# EAGLE schematic HAS (EAGLE 9.0.0)
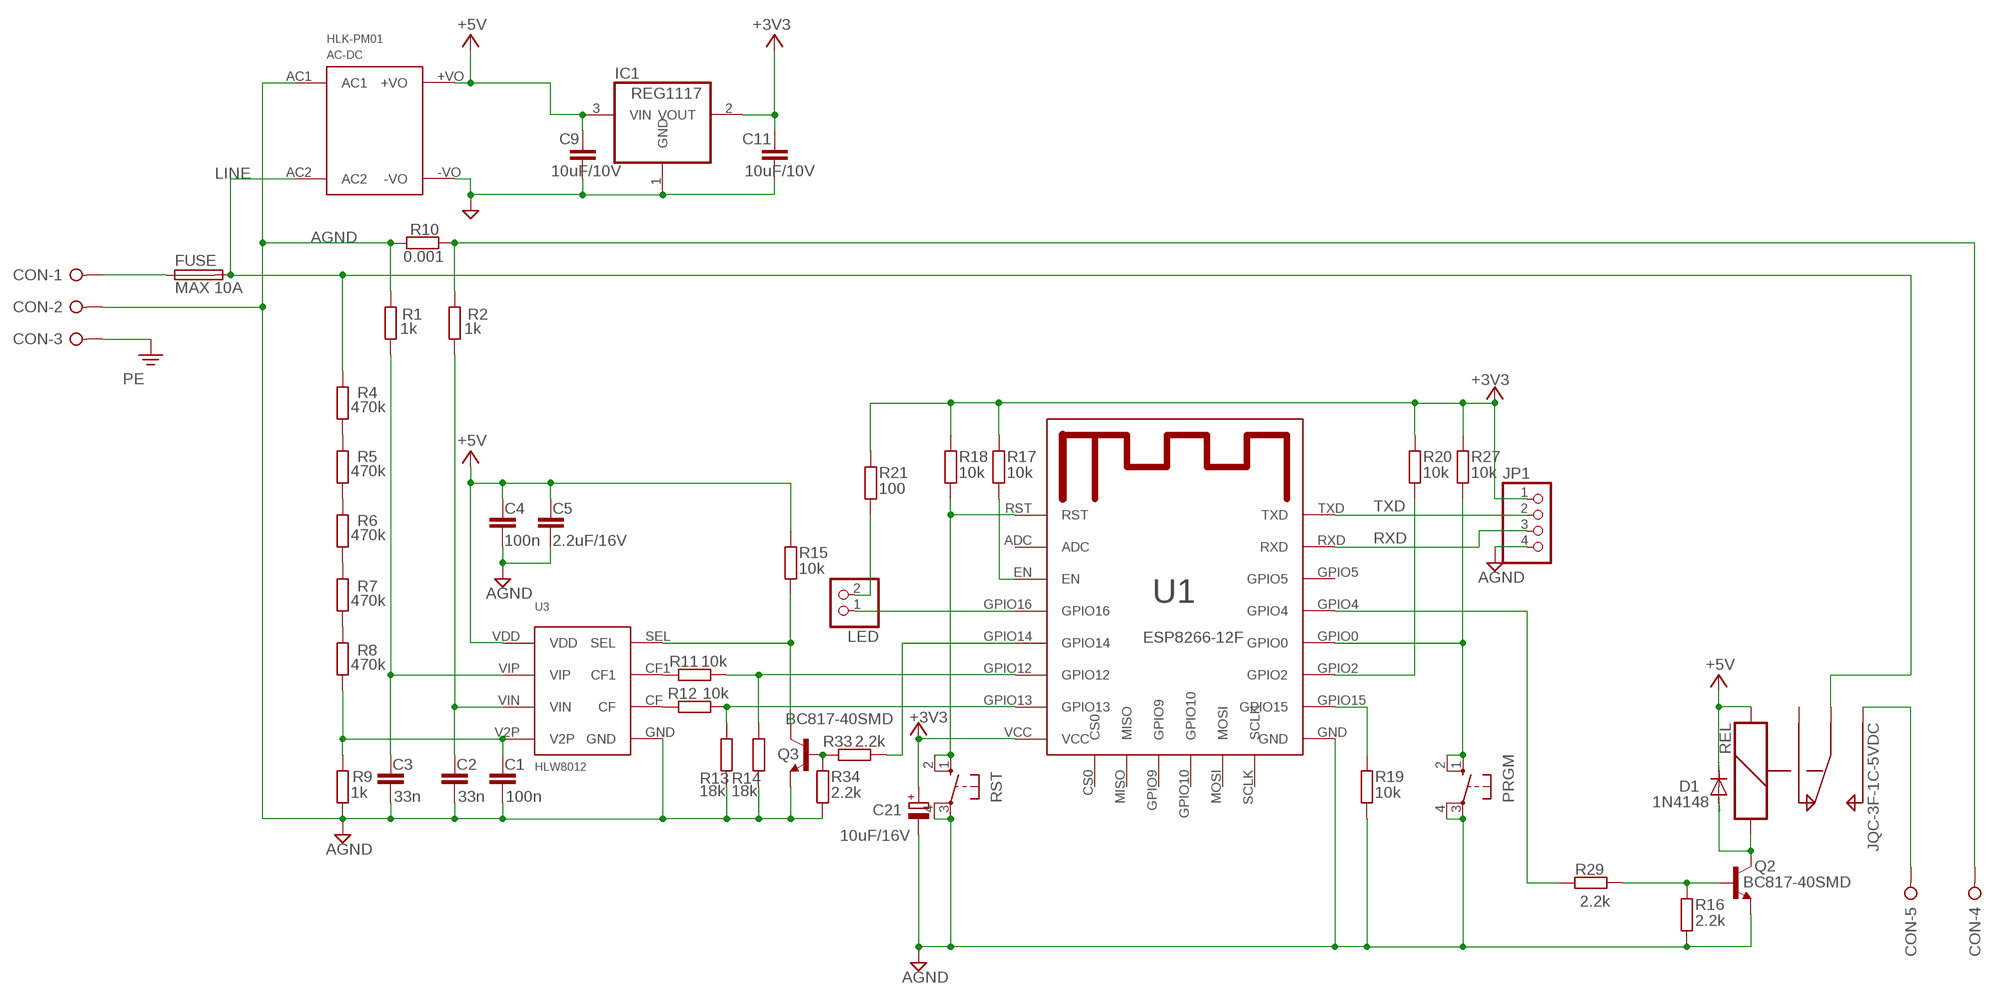
[diagram p0: schematic, sheet 1]

## Parts
AC-DC  HLK-PM01  [HLK-PM01]
C1  100n  C0805  [C0805]
C2  33n  C0805  [C0805]
C3  33n  C0805  [C0805]
C4  100n  C0805  [C0805]
C5  2.2uF/16V  C0805  [C0805]
C9  10uF/10V  C1206  [C1206]
C11  10uF/10V  C1206  [C1206]
C21  10uF/16V  TANT_B  [SMC_B]
CON  W237-05P  [W237-5P]
D1  1N4148  DIODE-SOD123  [SOD123]
FUSE  MAX 10A  FUSE  [SH22]
IC1  REG1117  [SOT223]
JP1  PINHD-1X4  [1X04]
LED  PINHD-1X2  [1X02]
PRGM  10-XX  [B3F-10XX]
Q2  BC817-40SMD  [SOT23-BEC]
Q3  BC817-40SMD  [SOT23-BEC]
R1  1k  R0805  [R0805]
R2  1k  R0805  [R0805]
R4  470k  R0805  [R0805]
R5  470k  R0805  [R0805]
R6  470k  R0805  [R0805]
R7  470k  R0805  [R0805]
R8  470k  R0805  [R0805]
R9  1k  R0805  [R0805]
R10  0.001  R2512  [R2512]
R11  10k  R0805  [R0805]
R12  10k  R0805  [R0805]
R13  18k  R0805  [R0805]
R14  18k  R0805  [R0805]
R15  10k  R0805  [R0805]
R16  2.2k  R0805  [R0805]
R17  10k  R0805  [R0805]
R18  10k  R0805  [R0805]
R19  10k  R0805  [R0805]
R20  10k  R0805  [R0805]
R21  100  R0805  [R0805]
R27  10k  R0805  [R0805]
R29  2.2k  R0805  [R0805]
R33  2.2k  R0805  [R0805]
R34  2.2k  R0805  [R0805]
REL  JQC-3F-1C-5VDC  [JQC-3F-1C-5VDC]
RST  10-XX  [B3F-10XX]
U1  ESP8266-12F  [ESP8266-12F]
U3  HLW8012  [HLW8012]

## Nets
+3V3: C11.2 C21.+ IC1.2(VOUT) JP1.1 R17.1 R18.1 R20.1 R21.1 R27.1 U1.VCC
+5V: AC-DC.+VO C4.1 C5.1 C9.2 D1.C IC1.3(VIN) R15.1 REL.R2 U3.VDD
AGND: AC-DC.-VO AC-DC.AC1 C1.2 C2.2 C3.2 C4.2 C5.2 C9.1 C11.1 C21.- CON.2 IC1.1(GND) JP1.4 PRGM.3(P) PRGM.4(P1) Q2.E Q3.E R1.1 R9.1 R10.1 R13.2 R14.2 R16.2 R19.2 R34.2 RST.3(P) RST.4(P1) U1.GND U3.GND
LINE: AC-DC.AC2 FUSE.2 R4.2 REL.COM
N: CON.4 R2.1 R10.2
N$1: C1.1 R8.1 R9.2 U3.V2P
N$2: R6.1 R7.2
N$3: Q3.C R15.2 U3.SEL
N$4: R11.1 U3.CF1
N$5: R12.1 U3.CF
N$6: C2.1 R2.2 U3.VIN
N$7: C3.1 R1.2 U3.VIP
N$8: R7.1 R8.2
N$9: R5.1 R6.2
N$10: R4.1 R5.2
N$11: LED.1 U1.GPIO16
N$12: R11.2 R14.1 U1.GPIO12
N$13: R12.2 R13.1 U1.GPIO13
N$14: R29.1 U1.GPIO4
N$15: Q2.B R16.1 R29.2
N$16: PRGM.1(S) PRGM.2(S1) R27.2 U1.GPIO0
N$17: Q3.B R33.2 R34.1
N$18: CON.5 REL.NO
N$19: R17.2 U1.EN
N$20: LED.2 R21.2
N$21: R18.2 RST.1(S) RST.2(S1) U1.RST
N$22: CON.1 FUSE.1
N$25: R20.2 U1.GPIO2
N$26: R33.1 U1.GPIO14
N$31: D1.A Q2.C REL.R1
N$38: R19.1 U1.GPIO15
PE: CON.3
RXD: JP1.3 U1.RXD
TXD: JP1.2 U1.TXD
Unconnected: REL.NC U1.ADC U1.CS0 U1.GPIO5 U1.GPIO9 U1.GPIO10 U1.MISO U1.MOSI U1.SCLK

## Library data of the parts
AC-DC = Components:HLK-PM01
C1-C5 = Components:C0805
C9 C11 = Components:C1206
C21 = Components:TANT_B
CON = con-wago-508:W237-05P: WAGO SREW CLAMP; OC_FARNELL: unknown; OC_NEWARK: unknown
D1 = diode:DIODE-: DIODE
FUSE = Components:FUSE
IC1 = Components:REG1117: 800mA and 1A Low Dropout (LDO) Positive Regulator 1.8V, 2.5V, 2.85V, 3.3V, 5V, and Adj; MPN: REG1117; OC_FARNELL: 1097566; OC_NEWARK: 14P6981
JP1 = pinhead:PINHD-1X4: PIN HEADER
LED = pinhead:PINHD-1X2: PIN HEADER
PRGM RST = switch-omron:10-XX: OMRON SWITCH; MPN: B3F-1000; OC_FARNELL: 176432; OC_NEWARK: 36M3542
Q2 Q3 = transistor-npn:BC817*: NPN Transistor
R1 R2 R4-R9 R11-R13 = Components:R0805
R10 = Components:R2512; SPICEPREFIX: R
R14-R21 R27 R29 R33 R34 = Components:R0805; SPICEPREFIX: R
REL = Components:JQC-3F-1C-5VDC
U1 = Components:ESP8266-12F
U3 = Components:HLW8012